# EAGLE design AmbaSat-01-SHT3x-DIS (EAGLE 9.3.2)
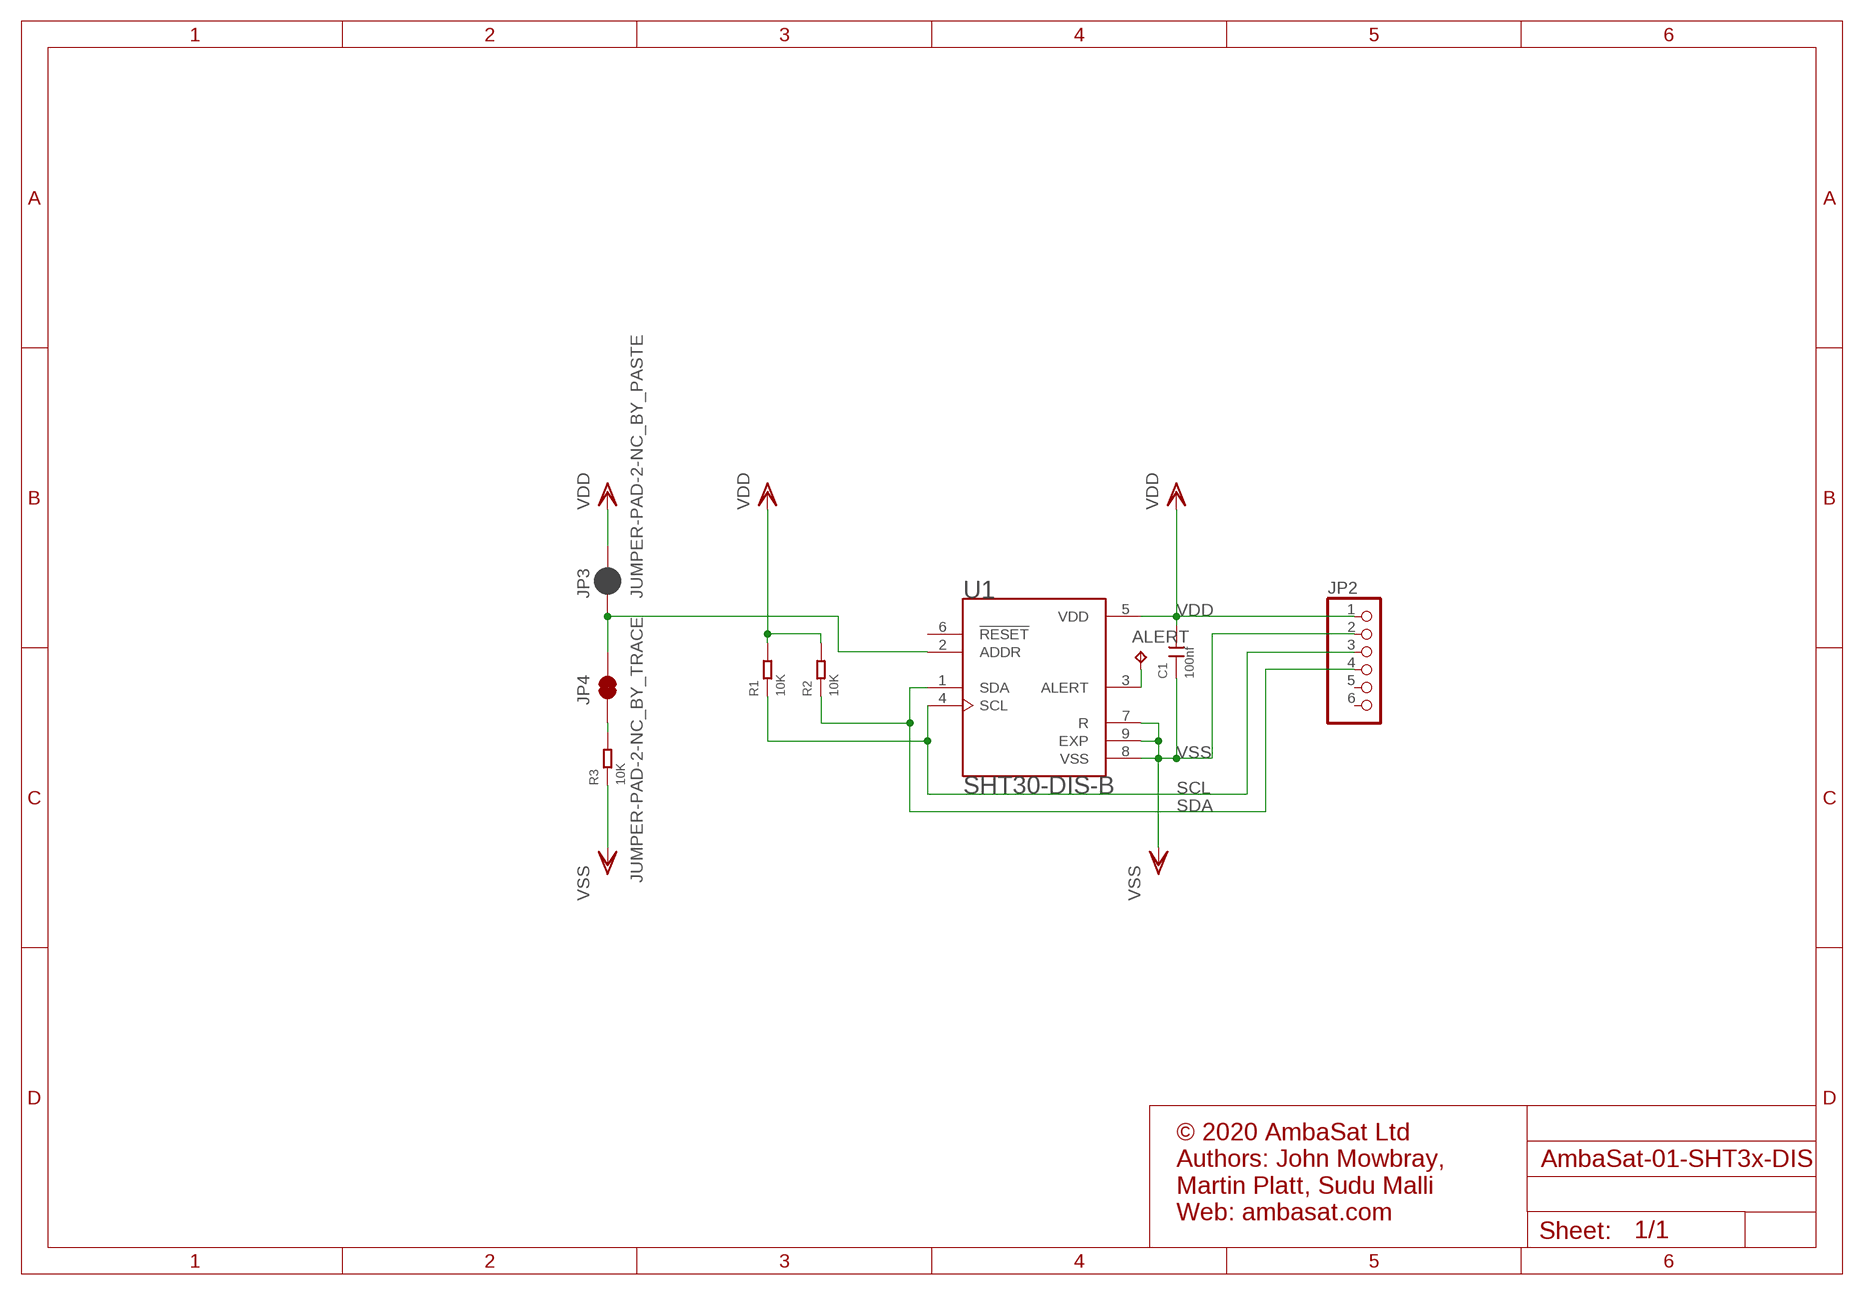
[diagram p0: schematic, sheet 1]

## Parts
ALERT  TPTP06R  [TP06R]
C1  100nf  CERAMIC-100NF-50V-10%-X7R(0805)  [C0805]
JP2  HEADER-1X6  [1X06_OVAL]
JP3  JUMPER-PAD-2-NC_BY_PASTE  [PAD-JUMPER-2-NC_BY_PASTE_YES_SILK]
JP4  JUMPER-PAD-2-NC_BY_TRACE  [PAD-JUMPER-2-NC_BY_TRACE_YES_SILK]
R1  10K  SMD-RES-10K-1%-1/8W(0805)  [R0805]
R2  10K  SMD-RES-10K-1%-1/8W(0805)  [R0805]
R3  10K  SMD-RES-10K-1%-1/8W(0805)  [R0805]
U1  SHT30-DIS-B  [DFN250X250X100-9N]

## Nets
N$1: JP3.1 JP4.2 U1.2(ADDR)
N$2: ALERT.TP U1.3(ALERT)
N$3: JP4.1 R3.2
SCL: JP2.3 R1.1 U1.4(SCL)
SDA: JP2.4 R2.1 U1.1(SDA)
VDD: C1.2 JP2.1 JP3.2 R1.2 R2.2 U1.5(VDD)
VSS: C1.1 JP2.2 R3.1 U1.7(R) U1.8(VSS) U1.9(EXP)
Unconnected: JP2.5 JP2.6 U1.6(!RESET)

## Notes on the sheet
- © 2020 AmbaSat Ltd
  Authors: John Mowbray, 
  Martin Platt, Sudu Malli
  Web: ambasat.com

## Library data of the parts
ALERT = testpad:TP: Test pad
C1 = Seeed-Capacitor:CERAMIC-100NF-50V-10%-X7R(0805): 302010165; MPN: CC0805KRX7R9BB104
JP2 = microbuilder:HEADER-1X6: PIN HEADER
JP3 = SparkFun-Passives:JUMPER-PAD-2-NC_BY_PASTE
JP4 = SparkFun-Passives:JUMPER-PAD-2-NC_BY_TRACE
R1-R3 = Seeed-Resistor:SMD-RES-10K-1%-1/8W(0805): 301010361; MPN: RC0805FR-0710KL
U1 = SHT30-DIS-B:SHT30-DIS-B: SHT3x Series 5.5 V ±3 %RH 0 to 100% Temperature and Humidity Sensor - DFN-8; AVAILABILITY: Unavailable; DESCRIPTION: SHT3x Series 5.5 V ±3 %RH 0 to 100% Temperature and Humidity Sensor - DFN-8; MF: Sensirion AG; MP: SHT30-DIS-B; PACKAGE: DFN-8 Sensirion; PRICE: None

## Board
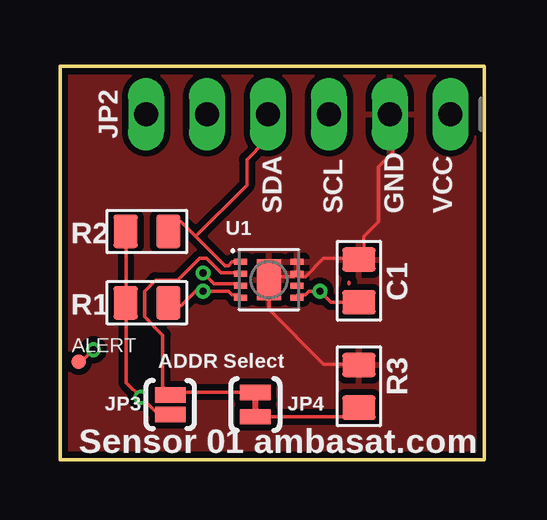
[diagram p1: board, top side]
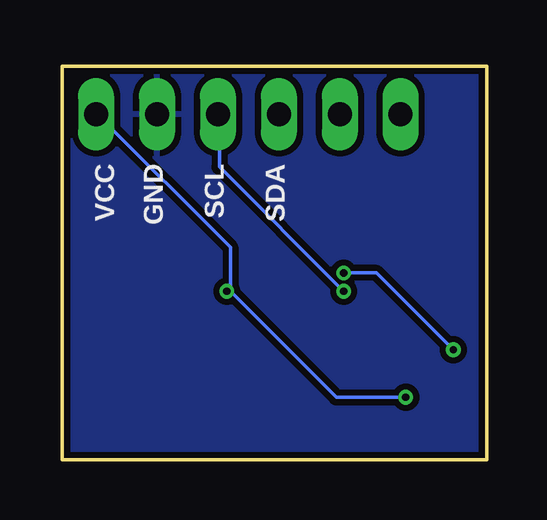
[diagram p2: board, bottom side, seen from below]

Size 17.7 x 16.4 mm. Coordinates in mm from the lower left corner, seen from the top.
Outline: 0,16.4 17.7,16.4 17.7,0 0,0 0,16.4
Copper layers (1*16): Top 0.035mm / dielectric 1.5mm / Bottom 0.035mm
Design rules "SeeedStudio_2layer_DRU_no_angle_20140221": minimum track width 6mil, minimum drill 12mil, track to track 6mil, track to pad 6mil, pad to pad 6mil, via to via 6mil, smd to smd 0mil, copper to edge 10mil, drill to drill 10mil, minimum pad ring 10mil, minimum via ring 6mil, stop-mask expansion 2mil, vias tented up to drill 100mil, thermal gap 10mil

### Footprints (pad centres in the part's own frame; a part is rotated, then mirrored left to right if it is on the bottom)
TP06R = smd 0.6 x 0.6: TP 0,0
C0805 = smd 1.397 x 1.016: 1 0,0.889; 2 0,-0.889
1X06_OVAL = drill 1 long: 1 -6.35,0; 2 -3.81,0; 3 -1.27,0; 4 1.27,0; 5 3.81,0; 6 6.35,0
PAD-JUMPER-2-NC_BY_PASTE_YES_SILK = smd 0.635 x 1.27: 1 -0.401,0; 2 0.413,0
PAD-JUMPER-2-NC_BY_TRACE_YES_SILK = smd 0.635 x 1.27: 1 -0.508,0; 2 0.508,0
R0805 = smd 1.397 x 1.016: 1 0,0.889; 2 0,-0.889
DFN250X250X100-9N = smd 0.55 x 0.25: 1 -1.175,0.75; 2 -1.175,0.25; 3 -1.175,-0.25; 4 -1.175,-0.75; 5 1.175,-0.75; 6 1.175,-0.25; 7 1.175,0.25; 8 1.175,0.75 | smd 1 x 1.7: 9 0,0

### Placement (x,y rotation side)
ALERT  0.78,4.08 0 top
C1  12.47,7.46 0 top
JP2  9.94,14.4 180 top
JP3  4.59,2.3 270 top
JP4  8.15,2.3 90 top
R1  3.63,6.55 270 top
R2  3.63,9.52 270 top
R3  12.47,3.07 0 top
U1  8.71,7.51 0 top

### Tracks (layer width: path | path; a pad name or v marks a point on that pad's centre or on a via)
N$1
  Top 0.152: JP4.2 4.7,2.81 JP3.1 4.59,2.76 4.29,3.07 4.29,5.2 3.53,5.96 3.53,7.03 3.98,7.49 4.9,7.49 5.81,8.4 6.12,8.4 6.73,7.79 7.49,7.79 U1.2
N$2  (via drill 0.3)
  Top 0.152: v5.97,7.79 6.42,7.33 7.49,7.33 U1.3 | v1.39,4.59 0.78,3.98 ALERT.TP
  Bottom 0.152: v5.97,7.79 4.59,7.79 v1.39,4.59
N$3
  Top 0.152: JP4.1 12.09,1.8 R3.2
SCL  (via drill 0.3)
  Top 0.152: U1.4 7.49,6.88 7.19,6.88 7.03,7.03 v5.97,7.03 5.66,7.03 5.05,6.42 4.59,6.42 R1.1
  Bottom 0.152: v5.97,7.03 11.15,12.21 11.15,14.34 JP2.3
SDA
  Top 0.152: 5.66,9.31 5.05,9.92 4.9,9.92 4.59,9.62 R2.1 | 5.66,9.31 6.88,8.1 7.03,8.1 7.19,8.25 7.49,8.25 U1.1 | 5.66,9.31 7.79,11.45 7.79,12.52 8.56,13.28 8.56,14.34 JP2.4
VDD  (via drill 0.3)
  Top 0.152: JP3.2 4.59,2 3.98,2 v3.38,2.61 2.77,3.22 2.77,6.42 R1.2 2.77,6.57 2.77,9.47 R2.2 | C1.2 11.3,6.57 v10.84,7.03 10.39,7.03 10.23,6.88 9.93,6.88 U1.5
  Bottom 0.152: 10.69,7.03 10.69,8.86 16.18,14.34 JP2.1 | v3.38,2.61 6.27,2.61 10.69,7.03 | 10.69,7.03 v10.84,7.03
VSS
  Top 0.152: U1.7 9.93,7.79 9.93,8.25 U1.8 | U1.7 9.78,7.64 8.71,7.64 U1.9 8.71,6.27 11,3.98 12.37,3.98 R3.1 | U1.7 9.93,7.64 10.23,7.64 11,8.4 12.37,8.4 C1.1 12.67,8.55 12.67,9.31 13.28,9.92 13.28,12.21 13.89,12.82 13.89,14.34 JP2.2
  pour Top (isolate 0.254): 0,16.4 0,0 17.7,0 17.7,16.4
  pour Bottom (isolate 0.254): 0,16.4 0,0 17.7,0 17.7,16.4
VSS_X2
  Top 0.152: 12.06,7.33 12.06,7.41

### Text on the board
tPlace: SDA | SCL | GND | VCC | ADDR Select | Sensor 01 ambasat.com
bPlace: SDA | SCL | GND | VCC